# Altium schematic sheet buttons.SchDoc
size A4; SheetNumber: 5; SheetTotal: 6
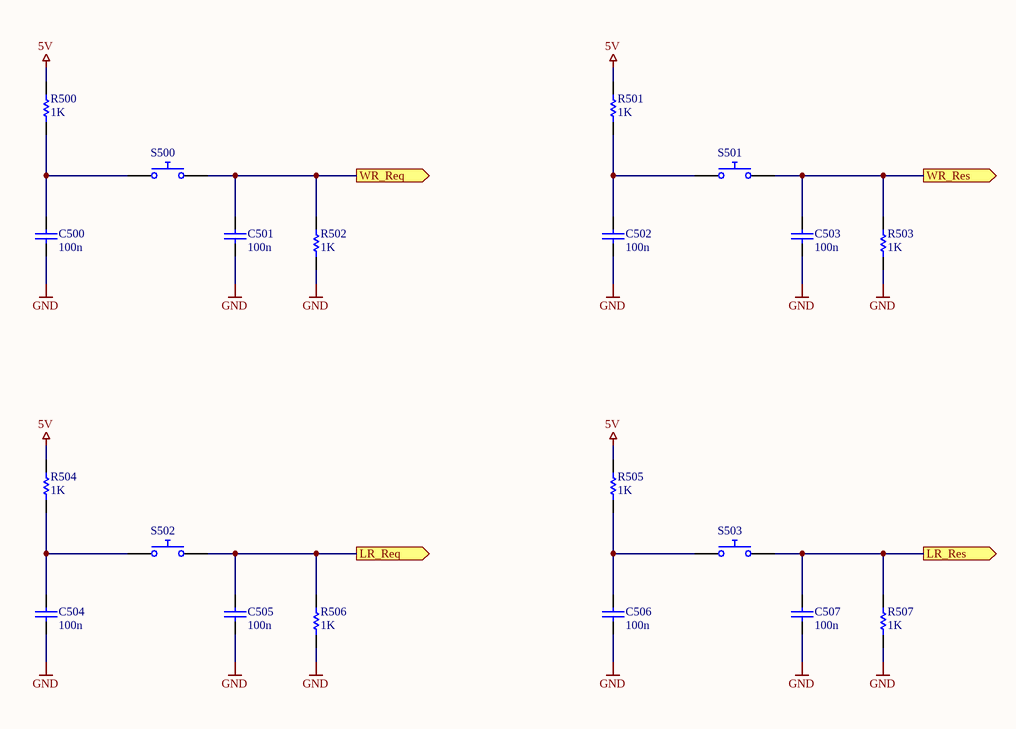
[diagram p0: buttons.SchDoc]

## Parts
C500  value 100n  (hidden comment: Capacitor)
C501  value 100n  (hidden comment: Capacitor)
C502  value 100n  (hidden comment: Capacitor)
C503  value 100n  (hidden comment: Capacitor)
C504  value 100n  (hidden comment: Capacitor)
C505  value 100n  (hidden comment: Capacitor)
C506  value 100n  (hidden comment: Capacitor)
C507  value 100n  (hidden comment: Capacitor)
R500  value 1K  (hidden comment: Resistor)
R501  value 1K  (hidden comment: Resistor)
R502  value 1K  (hidden comment: Resistor)
R503  value 1K  (hidden comment: Resistor)
R504  value 1K  (hidden comment: Resistor)
R505  value 1K  (hidden comment: Resistor)
R506  value 1K  (hidden comment: Resistor)
R507  value 1K  (hidden comment: Resistor)
S500  Push Button Normally Opened  (value not drawn)
S501  Push Button Normally Opened  (value not drawn)
S502  Push Button Normally Opened  (value not drawn)
S503  Push Button Normally Opened  (value not drawn)

## Ports
LR_Req (out), LR_Res (out), WR_Req (out), WR_Res (out)

## Nets
5V: R500.2 R501.2 R504.2 R505.2
GND: C500.1 C501.1 C502.1 C503.1 C504.1 C505.1 C506.1 C507.1 R502.1 R503.1 R506.1 R507.1
LR_Req: C505.2 R506.2 S502.2 ; port LR_Req
LR_Res: C507.2 R507.2 S503.2 ; port LR_Res
WR_Req: C501.2 R502.2 S500.2 ; port WR_Req
WR_Res: C503.2 R503.2 S501.2 ; port WR_Res
NetC500_2: C500.2 R500.1 S500.1
NetC502_2: C502.2 R501.1 S501.1
NetC504_2: C504.2 R504.1 S502.1
NetC506_2: C506.2 R505.1 S503.1

## Library data of the parts
C500-C507 = Capacitor: SimulationGenericComponent: True
R500-R507 = Resistor: TC1: 0; SimulationGenericComponent: True; TC2: 0
S500-S503 = Push Button NO: closed: 0; Rclosed: 1m; Ropen: 1Meg; SimulationGenericComponent: True